# EAGLE design 03 (EAGLE 7.5.0)
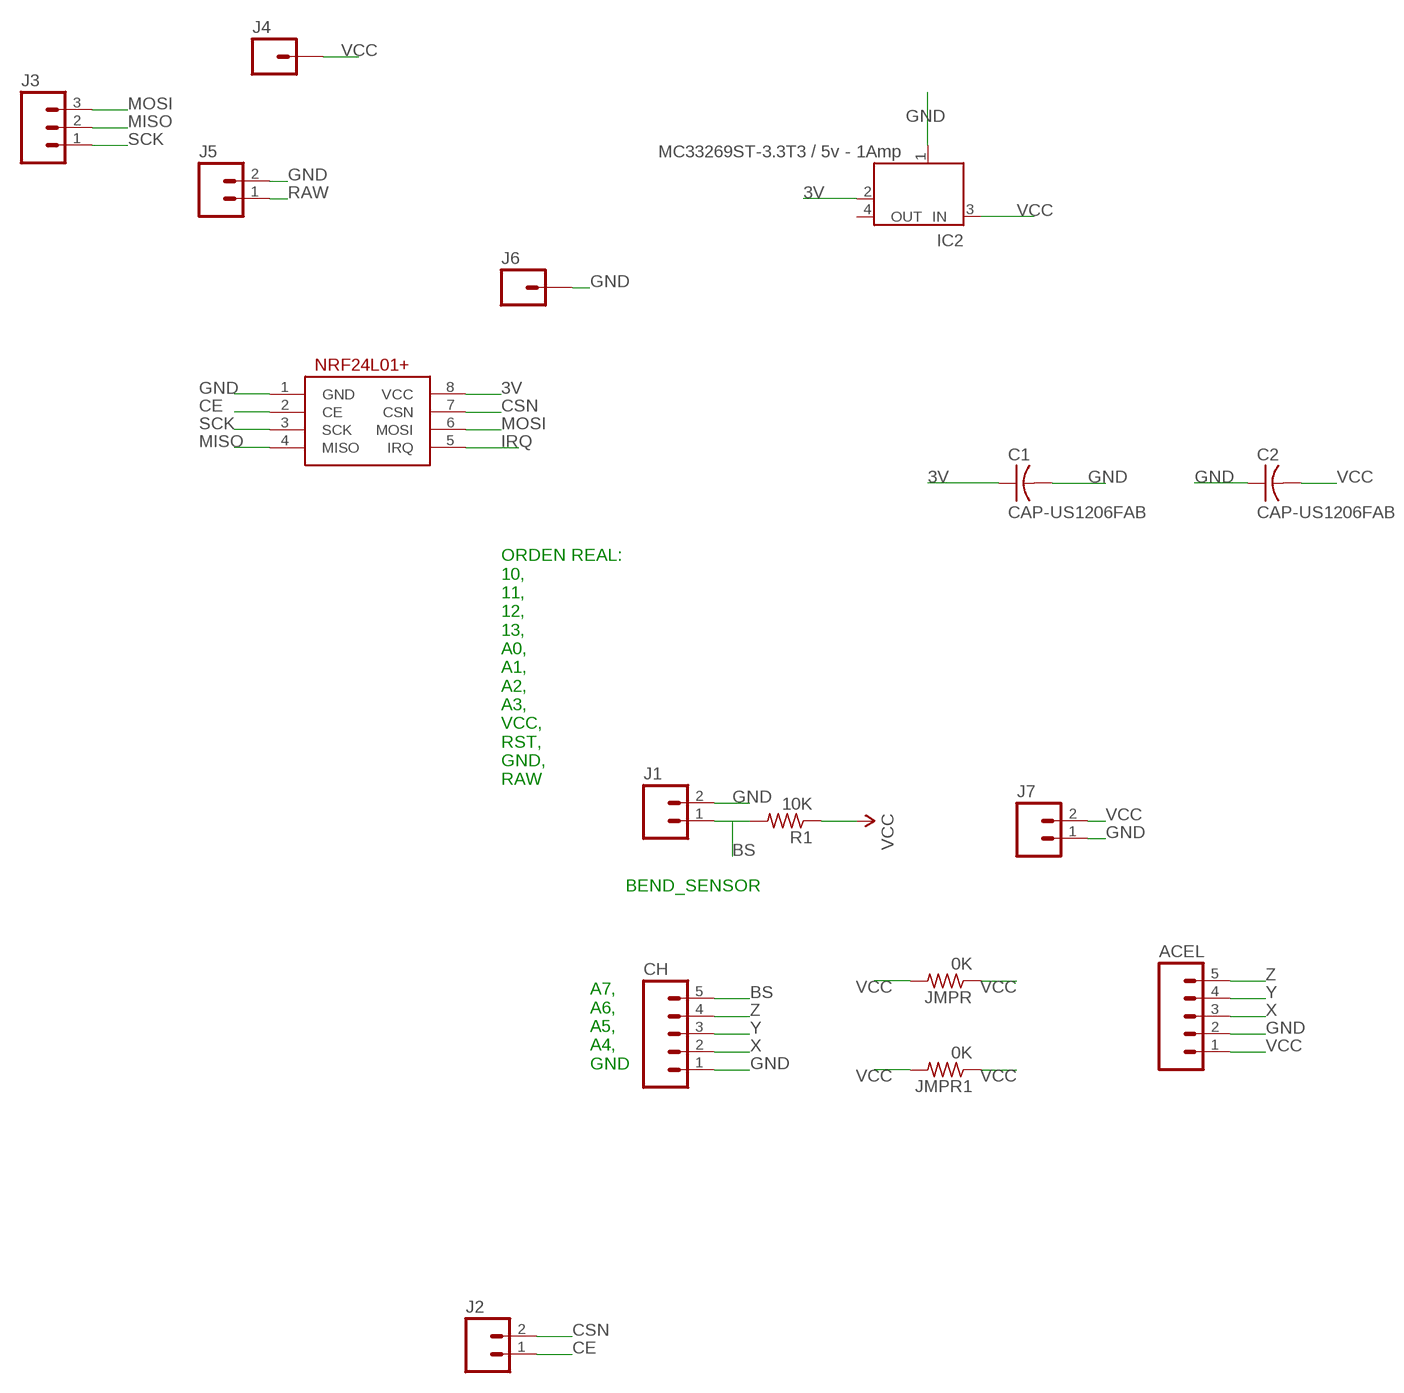
[diagram p0: schematic, sheet 1]

## Parts
ACEL  M05NO_SILK  [1X05_NO_SILK]
C1  CAP-US1206FAB  [C1206FAB]
C2  CAP-US1206FAB  [C1206FAB]
CH  M05NO_SILK  [1X05_NO_SILK]
IC2  MC33269ST-3.3T3 / 5v - 1Amp  MC33269ST-3.3T3  [SOT223]
J1  M021X02_NO_SILK  [1X02_NO_SILK]
J2  M021X02_NO_SILK  [1X02_NO_SILK]
J3  M031X03_NO_SILK  [1X03_NO_SILK]
J4  M01NOSILK-KIT  [1X01NS-KIT]
J5  M021X02_NO_SILK  [1X02_NO_SILK]
J6  M01PTH_NO_SILK_YES_STOP  [1X01_NO_SILK]
J7  M023.5MM  [SCREWTERMINAL-3.5MM-2]
JMPR  0K  RES-US1206FAB  [R1206FAB]
JMPR1  0K  RES-US1206FAB  [R1206FAB]
NRF24L01+  NRF24L01+  [2X04_THRU]
R1  10K  RES-US1206FAB  [R1206FAB]

## Nets
3V: C1.1 IC2.2(OUT) NRF24L01+.8(VCC)
BS: CH.5 J1.1 R1.2
CE: J2.1 NRF24L01+.2(CE)
CSN: J2.2 NRF24L01+.7(CSN)
GND: ACEL.2 C1.2 C2.1 CH.1 IC2.1(GND/ADJ) J1.2 J5.2 J6.1 J7.1 NRF24L01+.1(GND)
IRQ: NRF24L01+.5(IRQ)
MISO: J3.2 NRF24L01+.4(MISO)
MOSI: J3.3 NRF24L01+.6(MOSI)
RAW: J5.1
SCK: J3.1 NRF24L01+.3(SCK)
VCC: ACEL.1 C2.2 IC2.3(IN) J4.1 J7.2 JMPR1.1 JMPR1.2 JMPR.1 JMPR.2 R1.1
X: ACEL.3 CH.2
Y: ACEL.4 CH.3
Z: ACEL.5 CH.4
Unconnected: IC2.4(OUT)

## Notes on the sheet
- ORDEN REAL:
  10,
  11,
  12,
  13,
  A0,
  A1,
  A2,
  A3,
  VCC,
  RST,
  GND,
  RAW
- BEND_SENSOR
- A7,
  A6,
  A5,
  A4,
  GND

## Library data of the parts
ACEL CH = SparkFun-Connectors:M05: Header 5 Standard 5-pin 0.1" header. Use with straight break away headers (SKU : PRT-00116), right angle break away headers (PRT-00553), swiss pins (PRT-00743), machine pins (PRT-00117), and female headers (PRT-00115). Molex polarized connector foot print use with SKU : PRT-08230 with associated crimp pins and housings.
C1 C2 = fab:CAP-US
IC2 = linear:MC33269ST*: Adjustable Output Low Dropout Voltage Regulator 800 mA Source: http://www.onsemi.com/pub/Collateral/MC33269-D.PDF
J1 J2 J5 = SparkFun-Connectors:M02: Standard 2-pin 0.1" header. Use with - straight break away headers ( PRT-00116) - right angle break away headers (PRT-00553) - swiss pins (PRT-00743) - machine pins (PRT-00117) - female headers (PRT-00115) Molex polarized connector foot print use with: PRT-08233 with associated crimp pins and housings. 2.54_SCREWTERM for use with PRT-10571. 3.5mm Screw Terminal footprints for PRT-08084 5mm Screw Terminal footprints for use with PRT-08432
J3 = SparkFun-Connectors:M03: Header 3 Standard 3-pin 0.1" header. Use with straight break away headers (SKU : PRT-00116), right angle break away headers (PRT-00553), swiss pins (PRT-00743), machine pins (PRT-00117), and female headers (PRT-00115). Molex polarized connector foot print use with SKU : PRT-08232 with associated crimp pins and housings.
J4 J6 = SparkFun-Connectors:M01: Header 1 Standard 1-pin 0.1" header. Use with straight break away headers (SKU : PRT-00116), right angle break away headers (PRT-00553), swiss pins (PRT-00743), machine pins (PRT-00117), and female headers (PRT-00115). SMTSO-256-ET is a "flush mount" nut for a 4-40 screw. The older package used to be too tight, and did not allow it to sit properly thru the drill hit. The latest (0.165DIA) fits nice and snug.
J7 = SparkFun-Connectors:M02: Standard 2-pin 0.1" header. Use with - straight break away headers ( PRT-00116) - right angle break away headers (PRT-00553) - swiss pins (PRT-00743) - machine pins (PRT-00117) - female headers (PRT-00115) Molex polarized connector foot print use with: PRT-08233 with associated crimp pins and housings. 2.54_SCREWTERM for use with PRT-10571. 3.5mm Screw Terminal footprints for PRT-08084 5mm Screw Terminal footprints for use with PRT-08432; PROD_ID: CONN-08399
JMPR JMPR1 R1 = fab:RES-US: Resistor (US Symbol) Variants with postfix FAB are widened to allow the routing of internal traces
NRF24L01+ = fab:NRF24L01+: nRF24L01+ 2.4GHz Wireless Transceiver module

## Board
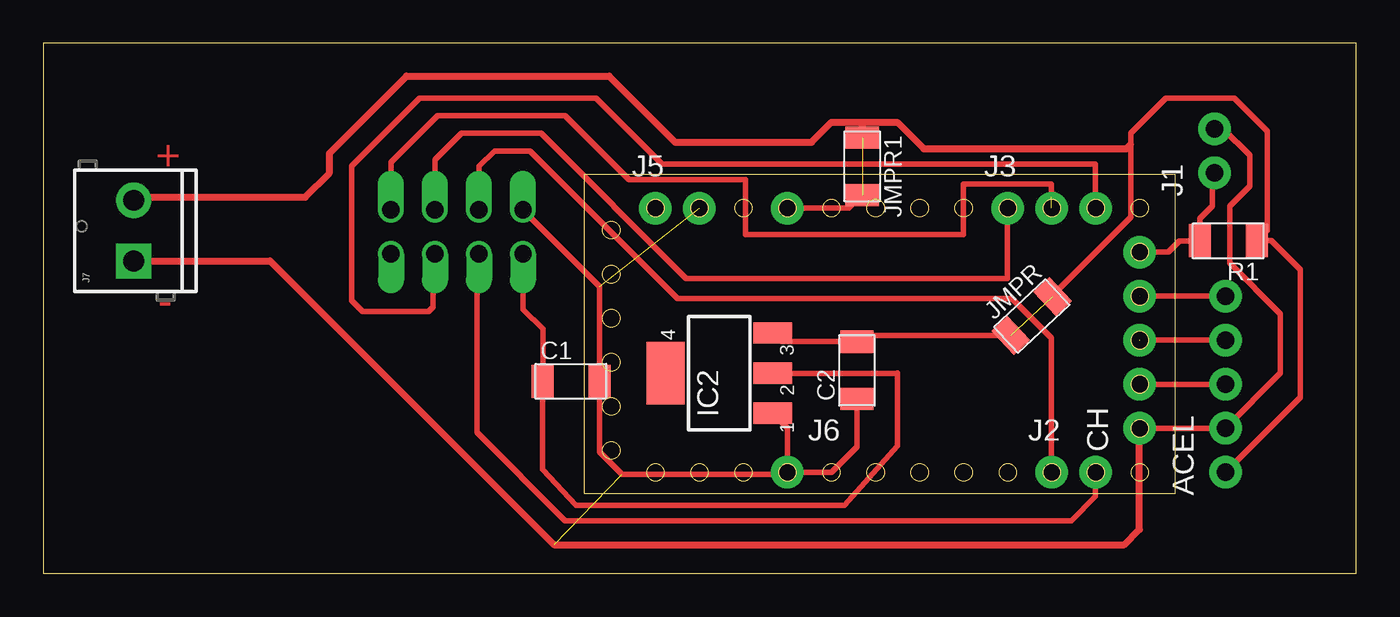
[diagram p1: board, top side]

Size 75.74 x 30.6 mm. Coordinates in mm from the lower left corner, seen from the top.
Outline: 0,0 75.74,0 75.74,30.6 0,30.6 0,18.4 0,0
Outline: 31.2,23.02 31.2,4.62 65.3,4.62 65.3,23.02 31.2,23.02
Outline: circle at 32.77,7.11 radius 0.5
Outline: circle at 32.77,9.65 radius 0.5
Outline: circle at 32.77,12.19 radius 0.5
Outline: circle at 32.77,14.73 radius 0.5
Outline: circle at 32.77,17.27 radius 0.5
Outline: circle at 32.77,19.81 radius 0.5
Outline: circle at 35.32,21.08 radius 0.5
Outline: circle at 37.86,21.08 radius 0.5
Outline: circle at 37.86,21.08 radius 0.5
Outline: circle at 40.4,21.08 radius 0.5
Outline: circle at 42.94,21.08 radius 0.5
Outline: circle at 45.48,21.08 radius 0.5
Outline: circle at 48.02,21.08 radius 0.5
Outline: circle at 50.56,21.08 radius 0.5
Outline: circle at 53.1,21.08 radius 0.5
Outline: circle at 55.64,21.08 radius 0.5
Outline: circle at 58.18,21.08 radius 0.5
Outline: circle at 60.72,21.08 radius 0.5
Outline: circle at 63.26,21.08 radius 0.5
Outline: circle at 63.26,18.54 radius 0.5
Copper layers (1*16): Top 0.035mm / dielectric 1.5mm / Bottom 0.035mm
Design rules "default *": minimum track width 10mil, minimum drill 24mil, track to track 16mil, track to pad 16mil, pad to pad 16mil, via to via 16mil, smd to smd 16mil, copper to edge 40mil, drill to drill 8mil, minimum pad ring 10mil, minimum via ring 8mil, stop-mask expansion 4mil, vias tented up to drill 0mil, thermal gap 10mil

### Footprints (pad centres in the part's own frame; a part is rotated, then mirrored left to right if it is on the bottom)
1X05_NO_SILK = drill 1.016 pad 1.88: 1 0,0; 2 2.54,0; 3 5.08,0; 4 7.62,0; 5 10.16,0
C1206FAB = smd 1.27 x 1.905: 1 -1.651,0; 2 1.651,0
SOT223 = smd 1.219 x 2.235: 1 -2.311,-3.099; 2 0,-3.099; 3 2.311,-3.099 | smd 3.6 x 2.2: 4 0,3.099
1X02_NO_SILK = drill 1.016 pad 1.88: 1 0,0; 2 2.54,0
1X03_NO_SILK = drill 1.016 pad 1.88: 1 0,0; 2 2.54,0; 3 5.08,0
1X01NS-KIT = drill 1.016 pad 1.88: 1 0,0
1X01_NO_SILK = drill 1.016 pad 1.88: 1 0,0
SCREWTERMINAL-3.5MM-2 = drill 1.2 pad 2.032 square: 1 0,0 | drill 1.2 pad 2.032: 2 3.5,0
R1206FAB = smd 1.27 x 1.905: 1 -1.651,0; 2 1.651,0
2X04_THRU = drill 1 offset: 1 -1.27,3.81; 2 -1.27,1.27; 3 -1.27,-1.27; 4 -1.27,-3.81; 5 1.27,-3.81; 6 1.27,-1.27; 7 1.27,1.27; 8 1.27,3.81

### Placement (x,y rotation side)
ACEL  68.2,5.84 90 top
C1  30.44,11.09 0 top
C2  46.94,11.72 90 top
CH  63.26,8.38 90 top
IC2  38.99,11.56 90 top
J1  67.56,23.11 90 top
J2  58.17,5.84 0 top
J3  55.63,21.08 0 top
J4  42.93,21.08 0 top
J5  35.31,21.08 0 top
J6  42.93,5.84 0 top
J7  5.21,18.03 90 top
JMPR  57.02,14.86 43 top
JMPR1  47.24,23.5 270 top
NRF24L01+  23.86,19.71 270 top
R1  68.36,19.2 180 top

### Tracks (layer width: path | path; a pad name or v marks a point on that pad's centre or on a via)
3V
  Top 0.305: IC2.2 42.11,11.53 49.25,11.53 49.28,11.56 49.28,7.37 46.23,3.94 30.73,3.94 28.79,6.01 C1.1 28.83,11.09 28.83,14.1 27.69,15.24 27.69,18.43 NRF24L01+.8
BS
  Top 0.305: CH.5 64.89,18.54 65.53,19.18 66.69,19.18 R1.2 66.71,20.48 67.44,21.21 67.44,22.99 J1.1
CE
  Top 0.305: NRF24L01+.2 25.15,20.99 25.15,23.5 26.04,24.38 28.07,24.38 36.58,15.88 55.88,15.88 58.17,13.59 J2.1
CSN
  Top 0.305: NRF24L01+.7 25.02,18.33 25.02,8.13 30.1,3.05 59.31,3.05 60.71,4.45 J2.2
GND  (2 unrouted)
  Top 0.305: J1.2 68.07,25.65 69.6,24.13 69.6,22.35 68.45,21.21 68.45,17.91 71.37,14.99 71.37,11.56 ACEL.2 CH.1 | C2.1 46.94,7.32 45.47,5.84 J6.1 | C1.2 32.13,11.05 | J6.1 42.8,5.71 33.4,5.71 32.09,7.02 C1.2 | 32.13,11.12 C1.2 | IC2.1 42.93,8.41 J6.1 | NRF24L01+.1 32.09,16.56 C1.2
  Top 0.406: J6.1 42.91,5.85 | CH.1 63.25,8.36 63.25,2.54 62.36,1.65 29.46,1.65 13.08,18.03 J7.1
MISO  (1 unrouted)
  Top 0.305: NRF24L01+.4 20.07,20.99 20.07,23.75 22.73,26.42 30.1,26.42 33.78,22.73 40.51,22.73 40.51,19.56 53.09,19.56 53.09,22.48 58.17,22.48 J3.2
  Top 0.406: 58.29,21.84 58.17,21.72
MOSI
  Top 0.305: NRF24L01+.6 22.48,18.33 22.48,15.37 22.23,15.11 18.41,15.11 17.78,15.75 17.78,23.5 21.72,27.43 31.88,27.43 35.69,23.62 60.71,23.62 J3.3
SCK
  Top 0.305: NRF24L01+.3 22.61,20.99 22.61,23.88 24.13,25.4 28.7,25.4 37.08,17.02 55.63,17.02 J3.1
VCC  (2 unrouted)
  Top 0.305: ACEL.1 72.52,10.16 72.52,17.53 70.84,19.2 R1.1 70.61,19.8 70.61,25.53 68.71,27.43 64.77,27.43 62.74,25.4 62.74,24.77 62.74,20.57 58.23,16.07 | JMPR.1 47.3,13.73 C2.2 42.58,13.37 IC2.3 | J4.1 46.48,21.08 JMPR1.2
  Top 0.406: JMPR.2 58.23,16.07 | J7.2 5.28,21.46 5.53,21.72 15.11,21.72 16.51,23.11 16.51,24.26 20.95,28.7 32.64,28.7 36.45,24.89 44.32,24.89 45.47,26.04 47.12,26.04 | 47.12,26.04 49.28,26.04 50.8,24.51 62.48,24.51 62.74,24.77 | JMPR1.1 47.24,25.91 47.12,26.04
X
  Top 0.305: CH.2 ACEL.3
Y  (1 unrouted)
  Top 0.305: CH.3 ACEL.4
Z  (1 unrouted)
  Top 0.305: CH.4 ACEL.5

### Text on the board
Top: + | -